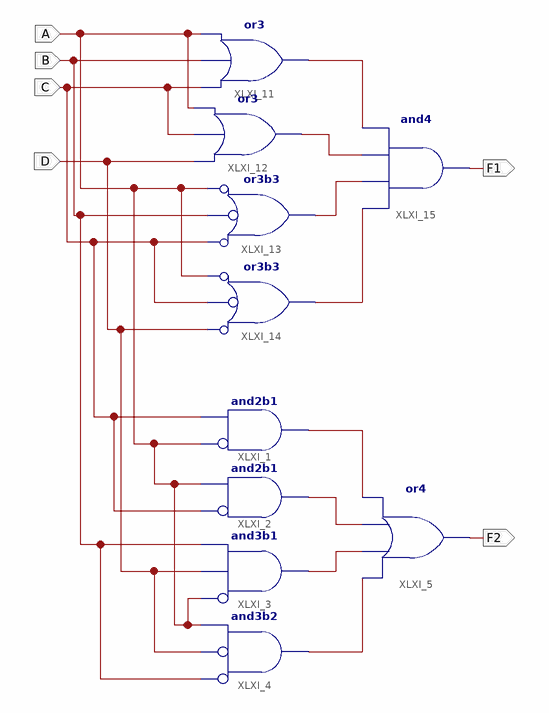
[diagram p0: schematic sheet 1]
// Xilinx ISE schematic Prob_2.sch (spartan3e) as structural Verilog: 10 symbols, 6 ports
module Prob_2 (
  input  A,
  input  B,
  input  C,
  input  D,
  output F2,
  output F1
);

  wire XLXN_59, XLXN_60, XLXN_61, XLXN_62, XLXN_63, XLXN_64, XLXN_65, XLXN_66;

  or XLXI_11 (XLXN_59, C, B, A);
  or XLXI_12 (XLXN_60, D, C, A);
  or XLXI_13 (XLXN_61, ~C, ~B, ~A);  // or3b3
  or XLXI_14 (XLXN_62, ~D, ~C, ~A);  // or3b3
  and XLXI_2 (XLXN_64, ~C, A);  // and2b1
  and XLXI_1 (XLXN_63, ~A, C);  // and2b1
  and XLXI_3 (XLXN_65, ~A, D, B);  // and3b1
  and XLXI_4 (XLXN_66, ~B, ~D, A);  // and3b2
  or XLXI_5 (F2, XLXN_66, XLXN_65, XLXN_64, XLXN_63);
  and XLXI_15 (F1, XLXN_62, XLXN_61, XLXN_60, XLXN_59);
endmodule
